# EAGLE design hub (EAGLE 7.3.0)
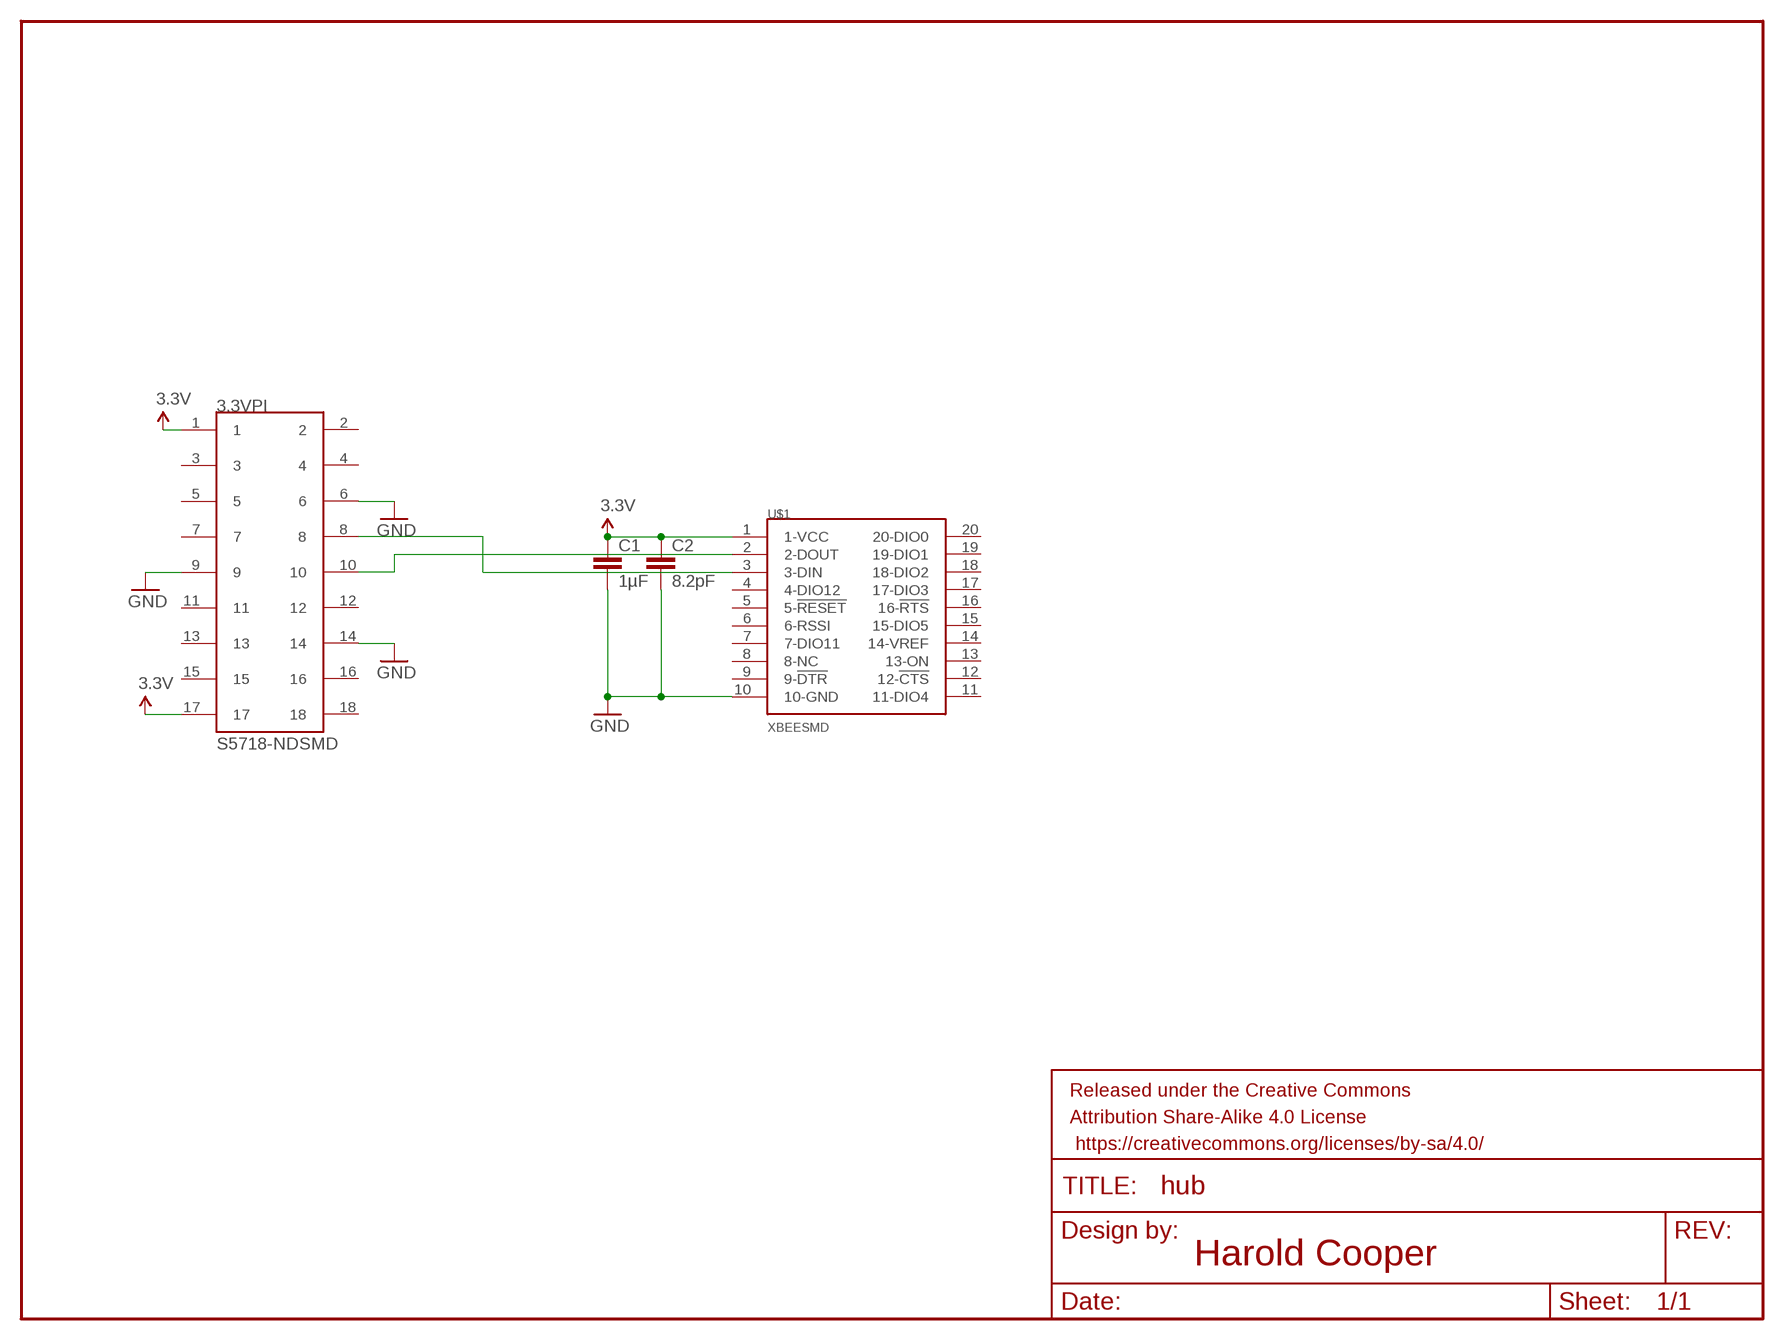
[diagram p0: schematic, sheet 1]

## Parts
3.3VPI  S5718-NDSMD  [CONN_HEADER_SMD_18]
C1  1µF  CAP0805  [0805]
C2  8.2pF  CAP0805  [0805]
FRAME1  FRAME-LETTER  [CREATIVE_COMMONS]
U$1  XBEESMD  [CONN_HEADER_SMD_10X2]

## Nets
3.3V: 3.3VPI.1 3.3VPI.17 C1.1 C2.1 U$1.1(1-VCC)
GND: 3.3VPI.6 3.3VPI.9 3.3VPI.14 C1.2 C2.2 U$1.10(10-GND)
N$1: 3.3VPI.10 U$1.2(2-DOUT)
N$2: 3.3VPI.8 U$1.3(3-DIN)
Unconnected: 3.3VPI.2 3.3VPI.3 3.3VPI.4 3.3VPI.5 3.3VPI.7 3.3VPI.11 3.3VPI.12 3.3VPI.13 3.3VPI.15 3.3VPI.16 3.3VPI.18 U$1.4(4-DIO12) U$1.5(5-!RESET) U$1.6(6-RSSI) U$1.7(7-DIO11) U$1.8(8-NC) U$1.9(9-!DTR) U$1.11(11-DIO4) U$1.12(12-!CTS) U$1.13(13-ON) U$1.14(14-VREF) U$1.15(15-DIO5) U$1.16(16-!RTS) U$1.17(17-DIO3) U$1.18(18-DIO2) U$1.19(19-DIO1) U$1.20(20-DIO0)

## Notes on the sheet
- Harold Cooper

## Library data of the parts
3.3VPI = heatseek_hub_smd_lib:S5718-ND
C1 C2 = SparkFun-Capacitors:CAP: Capacitor Standard 0603 ceramic capacitor, and 0.1" leaded capacitor.
FRAME1 = SparkFun-Aesthetics:FRAME-LETTER: Schematic Frame Standard 8.5x11 US Letter frame
U$1 = heatseek_hub_smd_lib:XBEE: XBEE-1(regular) SMD connector version

## Net classes
0 default: width 0.406 mm

## Board
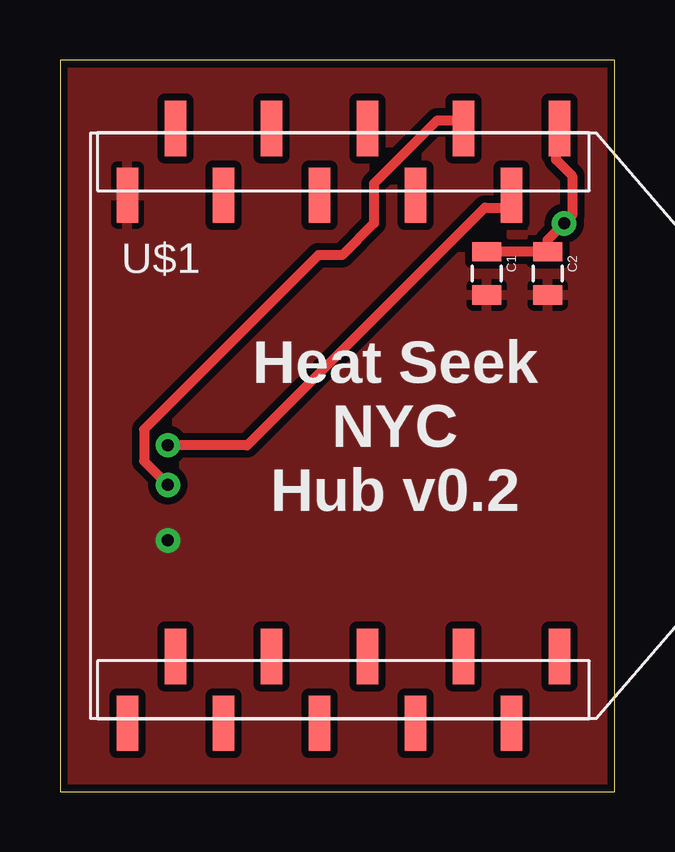
[diagram p1: board, top side]
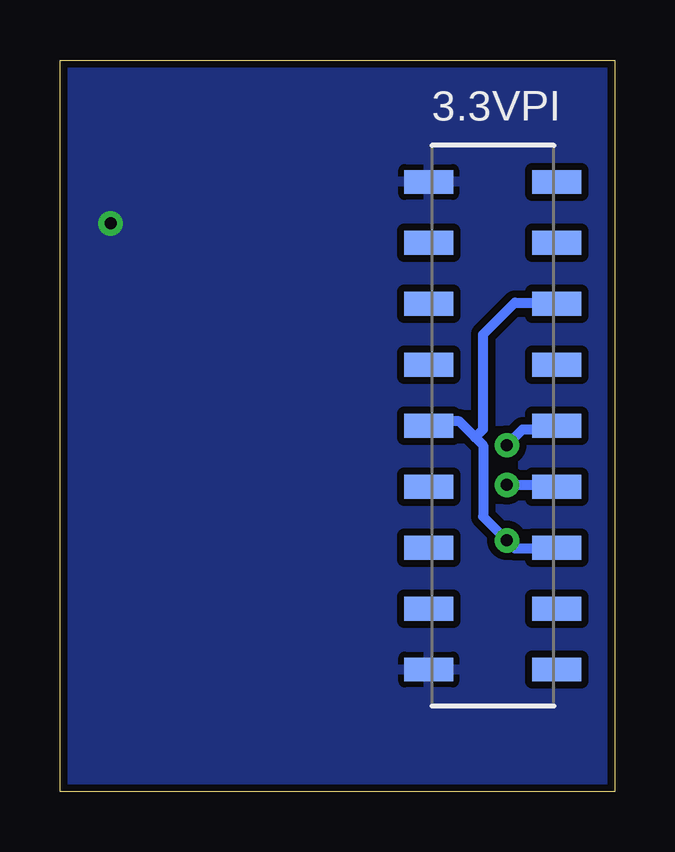
[diagram p2: board, bottom side, seen from below]

Size 23.11 x 30.48 mm. Coordinates in mm from the lower left corner, seen from the top.
Outline: 0,0 23.11,0 23.11,30.48 0,30.48 0,0
Copper layers (1*16): Top 0.035mm / dielectric 1.5mm / Bottom 0.035mm
Design rules "SparkFun-2-layer-STANDARD": minimum track width 10mil, minimum drill 20mil, track to track 10mil, track to pad 8mil, pad to pad 8mil, via to via 10mil, smd to smd 8mil, copper to edge 8mil, drill to drill 8mil, minimum pad ring 10mil, minimum via ring 10mil, stop-mask expansion 4mil, vias tented up to drill 20mil, thermal gap 10mil

### Footprints (pad centres in the part's own frame; a part is rotated, then mirrored left to right if it is on the bottom)
CONN_HEADER_SMD_18 = smd 2.032 x 0.991 bottom: 1 2.667,-10.16; 2 -2.667,-10.16; 3 2.667,-7.62; 4 -2.667,-7.62; 5 2.667,-5.08; 6 -2.667,-5.08; 7 2.667,-2.54; 8 -2.667,-2.54; 9 2.667,0; 10 -2.667,0; 11 2.667,2.54; 12 -2.667,2.54; 13 2.667,5.08; 14 -2.667,5.08; 15 2.667,7.62; 16 -2.667,7.62; 17 2.667,10.16; 18 -2.667,10.16
0805 = smd 0.8 x 1.2: 1 -0.9,0; 2 0.9,0
CONN_HEADER_SMD_10X2 = smd 0.89 x 2.3: 1 19.54,12.39; 2 17.54,9.61; 3 15.54,12.39; 4 13.54,9.61; 5 11.54,12.39; 6 9.54,9.61; 7 7.54,12.39; 8 5.54,9.61; 9 3.54,12.39; 10 1.54,9.61; 11 1.54,-12.39; 12 3.54,-9.61; 13 5.54,-12.39; 14 7.54,-9.61; 15 9.54,-12.39; 16 11.54,-9.61; 17 13.54,-12.39; 18 15.54,-9.61; 19 17.54,-12.39; 20 19.54,-9.61

### Placement (x,y rotation side)
3.3VPI  5.08,15.24 0 top
C1  17.78,21.59 270 top
C2  20.32,21.59 270 top
FRAME1  -11.43,39.37 0 top  (outside the outline)
U$1  1.27,15.24 0 top

### Tracks (layer width: path | path; a pad name or v marks a point on that pad's centre or on a via)
3.3V  (via drill 0.51)
  Top 0.406: U$1.1 20.68,27.5 20.68,26.31 21.34,25.65 21.34,24 v21.01,23.67 20.32,22.99 C2.1 C1.1
  pour Bottom (isolate 0.305): 0,0 0,30.48 23.11,30.48 23.11,0
GND  (via drill 0.51)
  Bottom 0.406: 5.82,14.76 6.48,15.42 7.57,15.42 3.3VPI.9 | 5.82,14.76 5.49,14.43 5.49,11.45 v4.5,10.46 4.17,10.13 2.44,10.13 3.3VPI.6 | 5.82,14.76 5.49,15.09 5.49,19.05 4.17,20.37 2.46,20.37 3.3VPI.14
  pour Top (isolate 0.305): 0,0 0,30.48 23.11,30.48 23.11,0
N$1  (via drill 0.51)
  Top 0.406: v4.5,14.43 7.8,14.43 17.7,24.33 18.81,24.33 U$1.2
  Bottom 0.406: v4.5,14.43 3.83,15.09 2.56,15.09 3.3VPI.10
N$2  (via drill 0.51)
  Top 0.406: v4.5,12.78 3.51,13.77 3.51,15.09 10.77,22.35 11.76,22.35 13.08,23.67 13.08,25.32 15.72,27.96 16.48,27.96 U$1.3
  Bottom 0.406: v4.5,12.78 2.49,12.78 3.3VPI.8

### Text on the board
tPlace: Heat Seek / NYC / Hub v0.2
tDocu: Harold Cooper, Doyun Kim